# Altium project MRF49XAmboard.PrjPcb
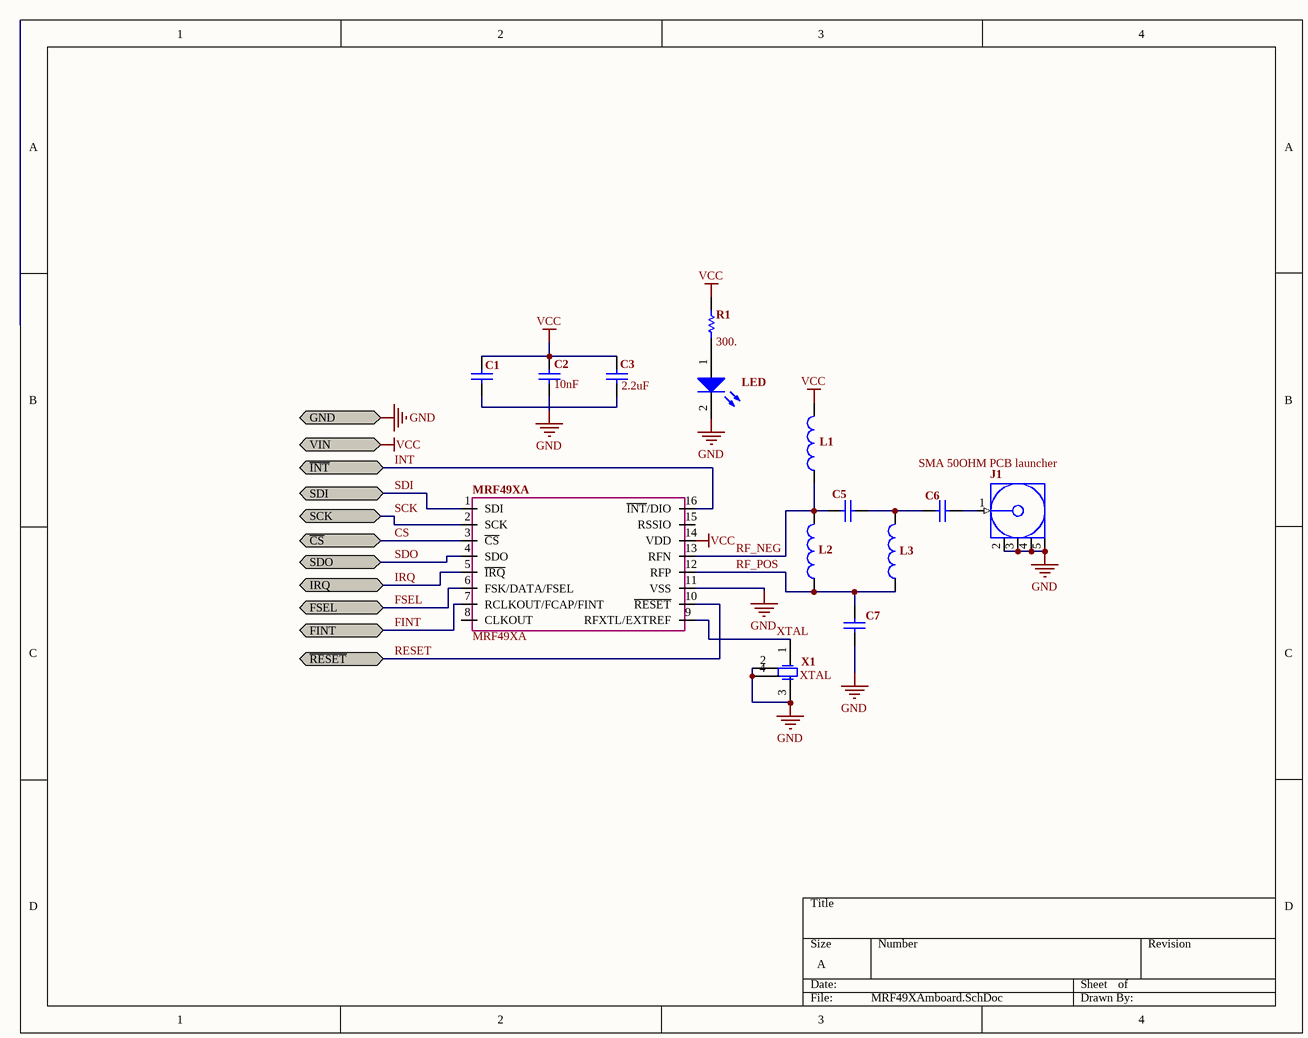
[diagram p0: MRF49XAmboard.SchDoc]
1 sheet, 14 parts. Net scope: flat (ports and power ports of the same name join across sheets).
Board files: MRF49XAmboard.PcbDoc, MRF49XAmboardPaneliced.PcbDoc

## Sheet MRF49XAmboard.SchDoc
size A

### Parts
C1  Cap  [1608[0603] - SERIGRAFIADO]  (value not drawn)
C2  value 10nF  [1608[0603] - Serigrafiado]  (hidden comment: Cap)
C3  value 2.2uF  [CAPC3216N]  (hidden comment: Cap)
C5  Cap  [1608[0603] - serigrafiado]  (value not drawn)
C6  Cap  [1608[0603] - serigrafiado]  (value not drawn)
C7  Cap  [1608[0603] - serigrafiado]  (value not drawn)
J1  SMA 50OHM PCB launcher  [SMA PCB LAUNCHER]
L1  L  [1608[0603] - serigrafiado]  (value not drawn)
L2  L  [1608[0603] - serigrafiado]  (value not drawn)
L3  L  [1608[0603] - serigrafiado]  (value not drawn)
LED  LED_SMD_Hg  [1608[0603] - SERIGRAFIADO]  (value not drawn)
MRF49XA  MRF49XA  [MRF49XA]
R1  value 300.  [1608[0603] - SERIGRAFIADO]  (hidden comment: Res1)
X1  XTAL  [XTC CRYSTAL]

### Ports
FINT, FSEL, GND, IRQ, SCK, SDI, SDO, VIN, ~{CS}, ~{INT}, ~{RESET}

### Nets
GND: C2.1 C7.1 J1.2(GND) J1.3(GND) J1.4(GND) J1.5(GND) LED.2(K) MRF49XA.11(VSS) X1.2(GND) X1.3(OSC2) X1.4(GND) ; port GND
VCC: C1.2 C2.2 C3.2 L1.2 MRF49XA.14(VDD) R1.2 ; port VIN
CS: MRF49XA.3(~{CS}) ; port ~{CS}
FINT: MRF49XA.7(RCLKOUT/FCAP/FINT) ; port FINT
FSEL: MRF49XA.6(FSK/DATA/FSEL) ; port FSEL
INT: MRF49XA.16(~{INT}/DIO) ; port ~{INT}
IRQ: MRF49XA.5(~{IRQ}) ; port IRQ
RESET: MRF49XA.10(~{RESET}) ; port ~{RESET}
RF_NEG: C5.2 L1.1 L2.2 MRF49XA.13(RFN)
RF_POS: C7.2 L2.1 L3.1 MRF49XA.12(RFP)
SCK: MRF49XA.2(SCK) ; port SCK
SDI: MRF49XA.1(SDI) ; port SDI
SDO: MRF49XA.4(SDO) ; port SDO
XTAL: MRF49XA.9(RFXTL/EXTREF) X1.1(OSC1)
NetC1_1: C1.1 C3.1
NetC5_1: C5.1 C6.2 L3.2
NetC6_1: C6.1 J1.1(Signal)
NetLED_1: LED.1(A) R1.1

Not connected (* = marked no-connect by the designer): MRF49XA 8(CLKOUT) 15(RSSIO)

### Library data of the parts
C1 = Cap: Capacitor; Value: 200pF; Published: 8-Jun-2000; LatestRevisionDate: 17-Jul-2002; LatestRevisionNote: Re-released for DXP Platform.; PackageReference: RAD-0.3; Publisher: Altium Limited; PackageDescription: Radial Cap, Thru-Hole; 2 Leads; 0.3 in Pin Spacing
C2 C3 = Cap: Capacitor; Published: 8-Jun-2000; LatestRevisionDate: 17-Jul-2002; LatestRevisionNote: Re-released for DXP Platform.; PackageReference: RAD-0.3; Publisher: Altium Limited; PackageDescription: Radial Cap, Thru-Hole; 2 Leads; 0.3 in Pin Spacing
C5 = Cap: Capacitor; Value: 2.7pF; Published: 8-Jun-2000; LatestRevisionDate: 17-Jul-2002; LatestRevisionNote: Re-released for DXP Platform.; PackageReference: RAD-0.3; Publisher: Altium Limited; PackageDescription: Radial Cap, Thru-Hole; 2 Leads; 0.3 in Pin Spacing
C6 = Cap: Capacitor; Value: 68pF; Published: 8-Jun-2000; LatestRevisionDate: 17-Jul-2002; LatestRevisionNote: Re-released for DXP Platform.; PackageReference: RAD-0.3; Publisher: Altium Limited; PackageDescription: Radial Cap, Thru-Hole; 2 Leads; 0.3 in Pin Spacing
C7 = Cap: Capacitor; Value: 5.1pF; Published: 8-Jun-2000; LatestRevisionDate: 17-Jul-2002; LatestRevisionNote: Re-released for DXP Platform.; PackageReference: RAD-0.3; Publisher: Altium Limited; PackageDescription: Radial Cap, Thru-Hole; 2 Leads; 0.3 in Pin Spacing
J1 = SMA 50OHM PCB launcher: SMA RF Coaxial PCB Connector, SM, Vertical Mount Socket, 50 Ohm Impedance; Published: 12-Dec-2006; DatasheetVersion: rev.A-0, Jul-2002; PackageVersion: rev.A-0, Jul-2002; PackageReference: 19-46-2; Publisher: Altium Limited; PackageDescription: SMA Straight PCB Surface Mount Jack Receptacle; ComponentLink1Description: Manufacturer Link; ComponentLink1URL: http://www.chinnan.com.tw/
L1 = L: Inductor; Manufacturer: Generic Components; Class: Passive; Value: 390nH; buy: farnell:1717469; Published: 08/06/2000; Publisher: Altium Hobart Technology Centre; SubClass: Inductor
L2 = L: Inductor; Manufacturer: Generic Components; Class: Passive; Value: 33nH; buy: farnell:1717469; Published: 08/06/2000; Publisher: Altium Hobart Technology Centre; SubClass: Inductor
L3 = L: Inductor; Manufacturer: Generic Components; Class: Passive; Value: 47nH; buy: farnell:1717469; Published: 08/06/2000; Publisher: Altium Hobart Technology Centre; SubClass: Inductor
LED = LED_SMD_Hg: Typical BLUE SiC LED; Manufacturer: Generic Components; Class: Optoelectronic; Published: 08/06/2000; Publisher: Altium Hobart Technology Centre; SubClass: LED
MRF49XA = MRF49XA: Sub-GHz RF transceiver supporting the 433/868/915MHz ISM frequency band
R1 = Res1: Resistor; Published: 8-Jun-2000; LatestRevisionDate: 17-Jul-2002; LatestRevisionNote: Re-released for DXP Platform.; PackageReference: AXIAL-0.3; Publisher: Altium Limited; PackageDescription: Axial Device, Thru-Hole; 2 Leads; 0.3 in Pin Spacing
X1 = XTAL: Crystal Oscillator; pin to pad: 2>2+4; Published: 8-Jun-2000; LatestRevisionDate: 17-Jul-2002; LatestRevisionNote: Re-released for DXP Platform.; PackageReference: R38; Publisher: Altium Limited; PackageDescription: Crystal, Thru-Hole; 2 Leads; Body 3.1 x 8.2 mm (Dia.xH)